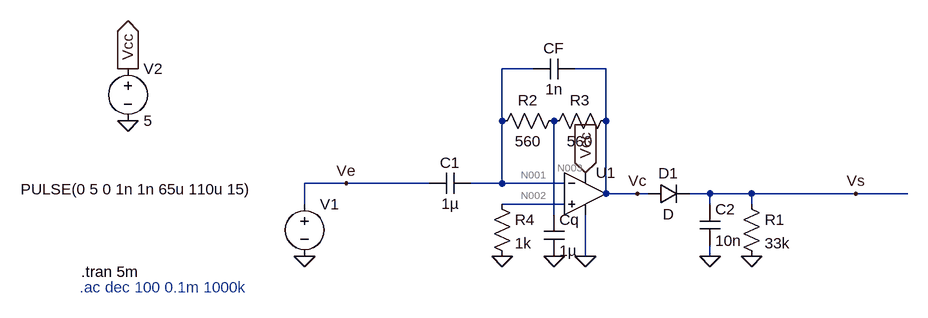
[diagram p0: schematic filtre_biz.asc]
filtre_biz.asc, the LTspice schematic file:
Version 4
SHEET 1 1076 680
WIRE 496 -80 448 -80
WIRE 608 -80 560 -80
WIRE 448 0 448 -80
WIRE 608 0 608 -80
WIRE 208 96 144 96
WIRE 336 96 208 96
WIRE 448 96 448 0
WIRE 448 96 400 96
WIRE 544 96 448 96
WIRE 608 112 608 0
WIRE 656 112 608 112
WIRE 672 112 656 112
WIRE 768 112 736 112
WIRE 832 112 768 112
WIRE 992 112 832 112
WIRE 1072 112 992 112
WIRE 144 128 144 96
WIRE 544 128 448 128
WIRE 768 128 768 112
WIRE 832 128 832 112
WIRE 528 144 528 0
WIRE 576 208 576 144
WIRE 768 208 768 192
FLAG 144 208 0
FLAG 448 208 0
FLAG 528 208 0
FLAG 576 208 0
FLAG 576 80 Vcc
IOPIN 576 80 In
FLAG -128 0 0
FLAG -128 -80 Vcc
IOPIN -128 -80 Out
FLAG 768 208 0
FLAG 832 208 0
FLAG 992 112 Vs
FLAG 656 112 Vc
FLAG 208 96 Ve
SYMBOL voltage 144 112 R0
WINDOW 3 -437 -7 Left 2
WINDOW 123 24 44 Left 2
WINDOW 39 0 0 Left 2
SYMATTR Value PULSE(0 5 0 1n 1n 65u 110u 15)
SYMATTR InstName V1
SYMBOL cap 400 80 R90
WINDOW 0 0 32 VBottom 2
WINDOW 3 32 32 VTop 2
SYMATTR InstName C1
SYMATTR Value 1µ
SYMBOL res 544 -16 R90
WINDOW 0 0 56 VBottom 2
WINDOW 3 32 56 VTop 2
SYMATTR InstName R2
SYMATTR Value 560
SYMBOL res 624 -16 R90
WINDOW 0 0 56 VBottom 2
WINDOW 3 32 56 VTop 2
SYMATTR InstName R3
SYMATTR Value 560
SYMBOL cap 560 -96 R90
WINDOW 0 0 32 VBottom 2
WINDOW 3 32 32 VTop 2
SYMATTR InstName CF
SYMATTR Value 1n
SYMBOL cap 512 144 R0
SYMATTR InstName Cq
SYMATTR Value 1µ
SYMBOL Opamps\\UniversalOpamp2 576 112 R0
SYMATTR InstName U1
SYMBOL voltage -128 -96 R0
WINDOW 123 0 0 Left 2
WINDOW 39 0 0 Left 2
SYMATTR InstName V2
SYMATTR Value 5
SYMBOL diode 672 128 R270
WINDOW 0 32 32 VTop 2
WINDOW 3 0 32 VBottom 2
SYMATTR InstName D1
SYMBOL cap 752 128 R0
SYMATTR InstName C2
SYMATTR Value 10n
SYMBOL res 816 112 R0
SYMATTR InstName R1
SYMATTR Value 33k
SYMBOL res 432 112 R0
SYMATTR InstName R4
SYMATTR Value 1k
TEXT -200 232 Left 2 !.tran 5m
TEXT -202 256 Left 2 ;.ac dec 100 0.1m 1000k

The netlist it stands for:
* filtre_biz.asc
V1 Ve 0 PULSE(0 5 0 1n 1n 65u 110u 15)
C1 N001 Ve 1µ
R2 N003 N001 560
R3 Vc N003 560
CF Vc N001 1n
Cq N003 0 1µ
XU1 N002 N001 Vcc 0 Vc level.2 Avol=1Meg GBW=10Meg Slew=10Meg ilimit=25m rail=0 Vos=0 phimargin=45 en=0 enk=0 in=0 ink=0 Rin=500Meg  ; pins IN+ IN- V+ V- OUT
V2 Vcc 0 5
D1 Vc Vs D
C2 Vs 0 10n
R1 Vs 0 33k
R4 N002 0 1k
.model D D
.lib standard.dio
.tran 5m
* .ac dec 100 0.1m 1000k
.lib UniversalOpamps2.sub
.backanno
.end

* Results of the author's LTspice run, read from the files saved beside the schematic
* Operating Point, zero values left out:
*   V(n001) = 3.381 mV
*   V(n003) = 3.379 mV
*   V(vc) = 3.376 mV
*   V(vcc) = 5 V
*   V(n002) = 5 µV
*   I(R4) = 5 nA
*   I(R3) = -4.993 nA
*   I(R2) = -4.993 nA
*   I(V2) = -13.02 µA
*   Ix(u1:1) = -5 nA
*   Ix(u1:2) = -4.993 nA
*   Ix(u1:3) = 13.02 µA
*   Ix(u1:4) = -12.99 µA
*   Ix(u1:5) = 4.993 nA
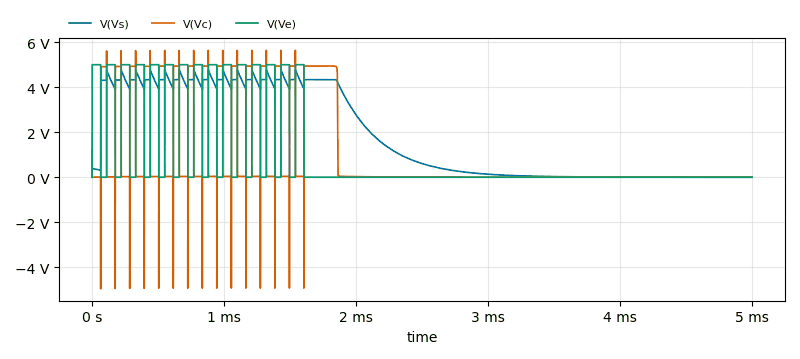
[diagram p1: Transient Analysis of filtre_biz.asc, plotted from the saved traces]
* Transient Analysis, 1 run:
*   V(Vs): min 0 V, max 4.776 V, average 1.836 V, rms 2.706 V, last 311.4 µV
*   V(Vc): min -4.956 V, max 5.637 V, average 880.9 mV, rms 2.073 V, last 1.476 mV
*   V(Ve): min 0 V, max 5 V, average 975 mV, rms 2.208 V, last 0 V